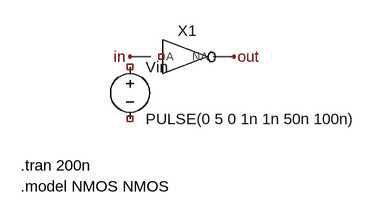
[diagram p0: schematic INVERT_TEST.asc]
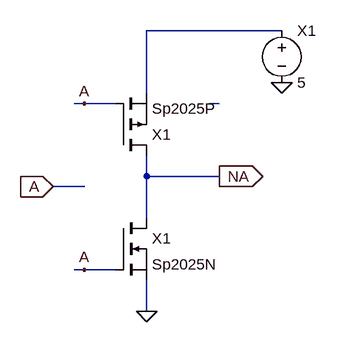
[diagram p1: sub-circuit invert.asc]
INVERT_TEST.asc, the LTspice schematic file:
Version 4
SHEET 1 880 680
.lib SHEET 1 880 680
WIRE 176 128 144 128
WIRE 304 128 272 128
FLAG 304 128 out
FLAG 144 128 in
SYMBOL INVERT 224 128 R0
SYMATTR InstName X1
SYMBOL voltage 144 128 R0
WINDOW 123 0 0 Left 0
WINDOW 39 0 0 Left 0
SYMATTR InstName Vin
SYMATTR Value PULSE(0 5 0 1n 1n 50n 100n)
TEXT -24 296 Left 2 !.tran 200n
TEXT -24 328 Left 2 !.model NMOS NMOS

invert.asc, the sub-circuit schematic file:
Version 4
SHEET 1 880 680
WIRE 352 -80 144 -80
WIRE 144 16 144 -80
WIRE 48 32 32 32
WIRE 96 32 48 32
WIRE 256 32 240 32
WIRE 144 144 144 112
WIRE 256 144 144 144
WIRE 48 160 0 160
WIRE 144 208 144 144
WIRE 48 288 32 288
WIRE 96 288 48 288
WIRE 144 352 144 304
FLAG 144 352 0
FLAG 0 160 A
IOPIN 0 160 In
FLAG 48 288 A
FLAG 48 32 A
FLAG 256 144 NA
IOPIN 256 144 Out
FLAG 352 0 0
SYMBOL pmos 96 112 M180
SYMATTR InstName X1
SYMATTR Value Sp2025P
SYMBOL nmos 96 208 R0
SYMATTR InstName X1
SYMATTR Value Sp2025N
SYMBOL voltage 352 -96 R0
SYMATTR InstName X1
SYMATTR Value 5

The netlist it stands for:
* INVERT_TEST.asc
XX1 NC_01 out invert
Vin NC_02 NC_03 PULSE(0 5 0 1n 1n 50n 100n)

* block symbol definitions
.subckt invert A NA
M§X1 NA A N001 N001 Sp2025P
M§X1 NA A 0 0 Sp2025N
V§X1 N001 0 5
.ends invert

.model NMOS NMOS
.model PMOS PMOS
.lib standard.mos
.tran 200n
.model NMOS NMOS
.backanno
.end